# Altium schematic sheet EEPROM.SchDoc
size 420 x 297 mm; SheetNumber: 11; SheetTotal: 20
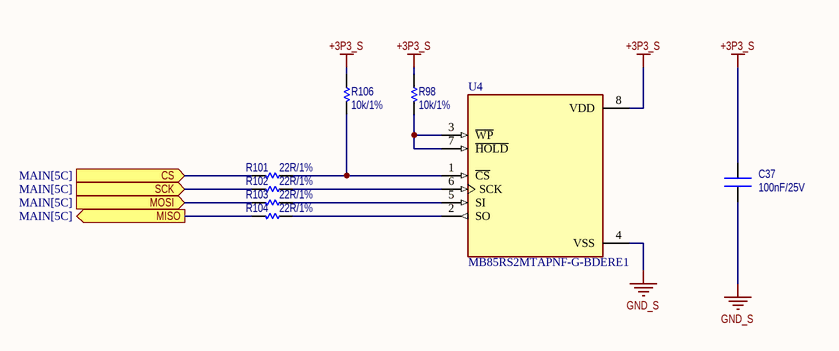
[diagram p0: EEPROM.SchDoc]

## Parts
C37  100nF/25V  [CN-SMD-0603]
R98  10k/1%  [RES-SMD-0603]
R101  22R/1%  [RES-SMD-0603]
R102  22R/1%  [RES-SMD-0603]
R103  22R/1%  [RES-SMD-0603]
R104  22R/1%  [RES-SMD-0603]
R106  10k/1%  [RES-SMD-0603]
U4  MB85RS2MTAPNF-G-BDERE1  [SOIC127P602X173-8N]

## Ports
CS (in, see MAIN[5C]), MISO (out, see MAIN[5C]), MOSI (in, see MAIN[5C]), SCK (in, see MAIN[5C])

## Nets
+3P3_S: C37.1 R98.1 R106.1 U4.8(VDD)
GND_S: C37.2 U4.4(VSS)
CS: R101.2 ; port CS
MISO: R104.2 ; port MISO
MOSI: R103.2 ; port MOSI
SCK: R102.2 ; port SCK
NetR98_2: R98.2 U4.3(~{WP}) U4.7(~{HOLD})
NetR101_1: R101.1 R106.2 U4.1(~{CS})
NetR102_1: R102.1 U4.6(SCK)
NetR103_1: R103.1 U4.5(SI)
NetR104_1: R104.1 U4.2(SO)

## Notes on the sheet
- Project:
- Sub-system:
- Design by:
- Sheet title:
- Sheet
- of
- Checked by:
- Approved by:
- Document No:
- Revision:
- Size:
- Date:

## Library data of the parts
C37 = CN: CAP CER 0.1UF 25V X7R 0603; PN: CL10B104KA8NNNC
R98 R106 = Res-SMD: RES SMD 10K OHM 1% 1/10W 0603; Manufacturer: Generic Components; PN: ERJ-3EKF1002V; Class: Passive; Publisher: Altium Hobart Technology Centre
R101-R104 = Res-SMD: RES SMD 22 OHM 1% 1/10W 0603; PN: ERJ-3EKF22R0V
U4 = MB85RS2MTAPNF-G-BDERE1: IC FRAM 2MBIT SPI 40MHZ 8SOP; MF: Fujitsu Electronics; SnapEDA_Link: https://www.snapeda.com/parts/MB85RS2MTAPNF-G-BDERE1/Fujitsu/view-part/?ref=snap; Package: SO-8 Fujitsu; Value: *; MP: MB85RS2MTAPNF-G-BDERE1; Check_prices: https://www.snapeda.com/parts/MB85RS2MTAPNF-G-BDERE1/Fujitsu/view-part/?ref=eda; PN: MB85RS2MTAPNF-G-BDERE1